# Altium project Uav.PrjPcb
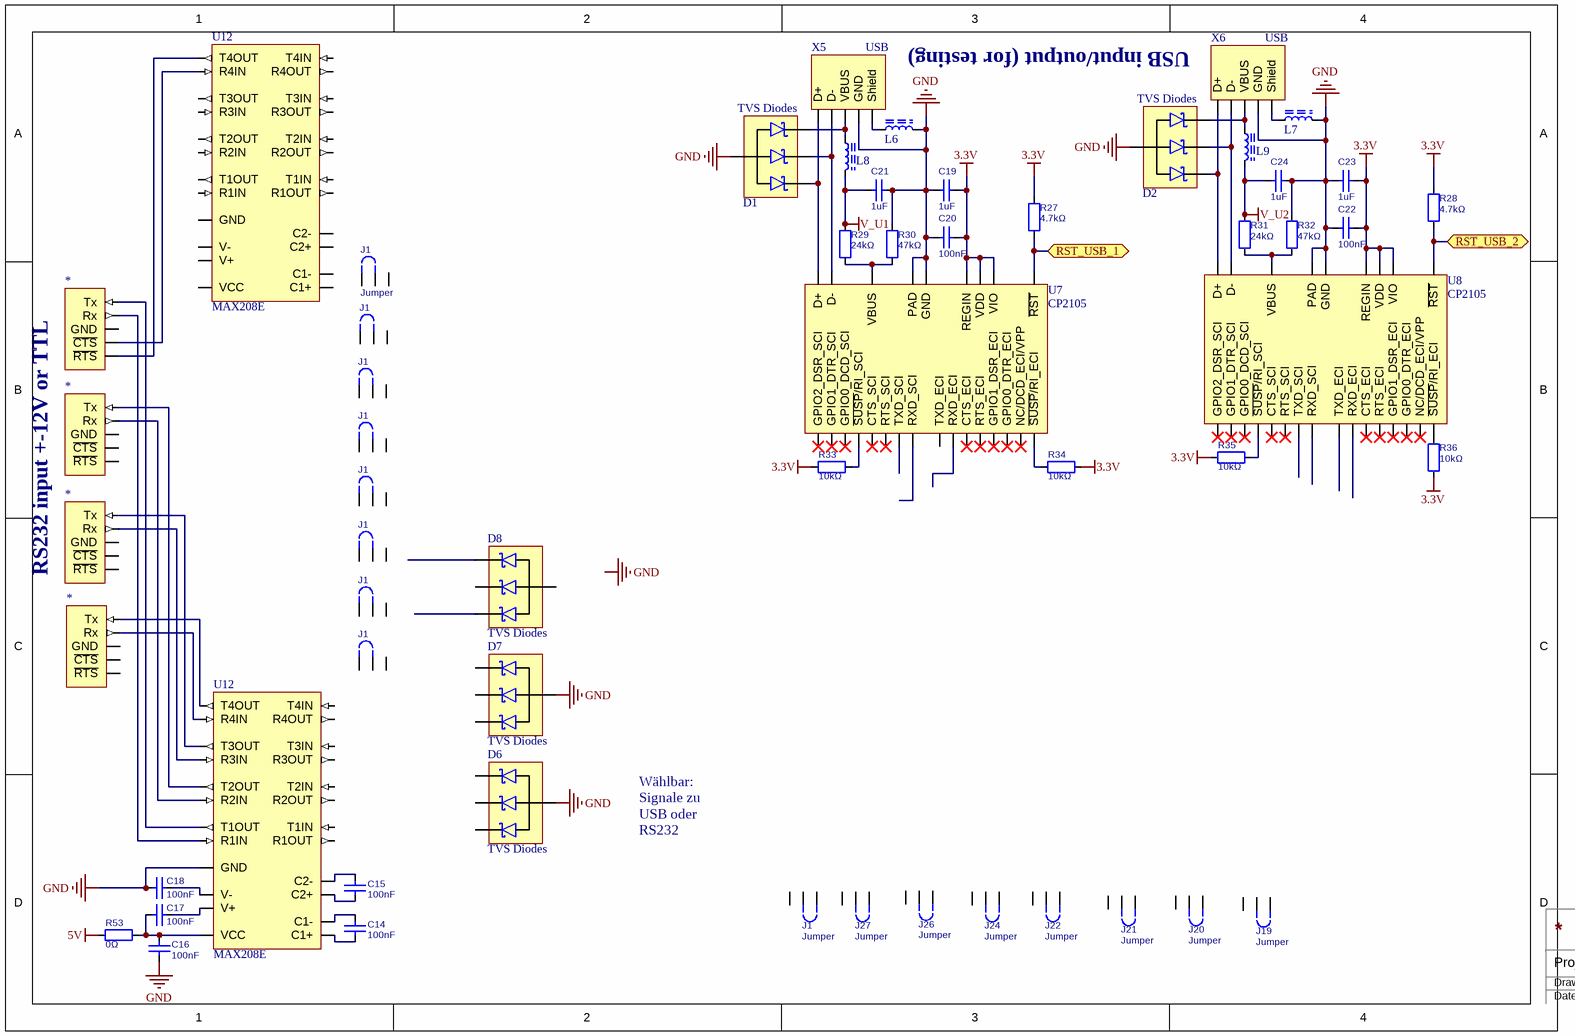
[diagram p0: DeviceDrivers.SchDoc]
2 sheets, 67 parts. Net scope: flat (ports and power ports of the same name join across sheets).
Board file: Uav_V2.PcbDoc
Sheets:
  DeviceDrivers.SchDoc
  WirelessDrivers.SchDoc

## Sheet DeviceDrivers.SchDoc
size A4; Organization: HSLU T&A; Address1: Abteilung Elektrotechnik; Address2: Technikumsstrasse 21; Address3: CH-6048 Horw

### Parts
(Parts that share a designator on the sheet are numbered #1, #2 ... from top to bottom, then left to right.)
*#1  RS232  (value not drawn)
*#2  RS232  (value not drawn)
*#3  RS232  (value not drawn)
*#4  RS232  (value not drawn)
C14  100nF  [0603]
C15  100nF  [0603]
C16  100nF  [0603]
C17  100nF  [0603]
C18  100nF  [0603]
C19  1uF  [0603]
C20  100nF  [0603]
C21  1uF  [0603]
C22  100nF  [0603]
C23  1uF  [0603]
C24  1uF  [0603]
D1  TVS Diodes  [SOT-143-4]
D2  TVS Diodes  [SOT-143-4]
D6  TVS Diodes  [SOT-143-4]
D7  TVS Diodes  [SOT-143-4]
D8  TVS Diodes  [SOT-143-4]
J1#1  Jumper  [HDR1X3]
J1#2  Jumper  [HDR1X3]  (value not drawn)
J1#3  Jumper  [HDR1X3]  (value not drawn)
J1#4  Jumper  [HDR1X3]  (value not drawn)
J1#5  Jumper  [HDR1X3]  (value not drawn)
J1#6  Jumper  [HDR1X3]  (value not drawn)
J1#7  Jumper  [HDR1X3]  (value not drawn)
J1#8  Jumper  [HDR1X3]  (value not drawn)
J1#9  Jumper  [HDR1X3]
J19  Jumper  [HDR1X3]
J20  Jumper  [HDR1X3]
J21  Jumper  [HDR1X3]
J22  Jumper  [HDR1X3]
J24  Jumper  [HDR1X3]
J26  Jumper  [HDR1X3]
J27  Jumper  [HDR1X3]
L6  MPZ1608S601A  [0603]  (value not drawn)
L7  MPZ1608S601A  [0603]  (value not drawn)
L8  MPZ1608S601A  [0603]  (value not drawn)
L9  MPZ1608S601A  [0603]  (value not drawn)
R27  4.7kΩ  [0603]
R28  4.7kΩ  [0603]
R29  24kΩ  [0603]
R30  47kΩ  [0603]
R31  24kΩ  [0603]
R32  47kΩ  [0603]
R33  10kΩ  [0603]
R34  10kΩ  [0603]
R35  10kΩ  [0603]
R36  10kΩ  [0603]
R53  0Ω  [0603]
U7  CP2105  [QFN24]
U8  CP2105  [QFN24]
U12#1  MAX208E  [SSOP24]
U12#2  MAX208E  [SSOP24]
X5  USB  [ZX63-B-5PA(30)]
X6  USB  [ZX63-B-5PA(30)]

### Ports
RST_USB_1, RST_USB_2

### Nets
3.3V: C19.1 C20.1 C22.1 C23.1 R27.2 R28.2 R33.2 R34.1 R35.2 R36.1 U7.5(VIO) U7.6(VDD) U7.7(REGIN) U8.5(VIO) U8.6(VDD) U8.7(REGIN)
5V: R53.2
GND: C16.2 C18.1 C19.2 C20.2 C21.1 C22.2 C23.2 C24.1 D1.1(CA) D2.1(CA) D6.1(CA) D7.1(CA) L6.2 L7.2 R30.1 R32.1 U7.2(GND) U7.25(PAD) U8.2(GND) U8.25(PAD) U12#2.8(GND) X5.4(GND) X6.4(GND)
V_U1: C21.2 L8.2 R29.1
V_U2: C24.2 L9.2 R31.1
Net*#1_1: *#1.1(Tx) U12#2.2(T1OUT)
Net*#1_2: *#1.2(Rx) U12#2.7(R1IN)
Net*#1_3: *#1.3(GND) U12#1.16(R4IN)
Net*#1_3: *#1.3(~{RTS}) U12#1.20(T4OUT)  [a separate net that carries the same name]
Net*#2_1: *#2.1(Tx) U12#2.1(T2OUT)
Net*#2_2: *#2.2(Rx) U12#2.3(R2IN)
Net*#3_1: *#3.1(Tx) U12#2.24(T3OUT)
Net*#3_2: *#3.2(Rx) U12#2.23(R3IN)
Net*#4_1: *#4.1(Tx) U12#2.20(T4OUT)
Net*#4_2: *#4.2(Rx) U12#2.16(R4IN)
NetC14_1: C14.1 U12#2.12(C1-)
NetC14_2: C14.2 U12#2.10(C1+)
NetC15_1: C15.1 U12#2.14(C2-)
NetC15_2: C15.2 U12#2.13(C2+)
NetC16_1: C16.1 C17.1 R53.1 U12#2.9(VCC)
NetC17_2: C17.2 U12#2.11(V+)
NetC18_2: C18.2 U12#2.15(V-)
NetD1_2: D1.2(K1) U7.3(D+) X5.3(D+)
NetD1_3: D1.3(K2) U7.4(D-) X5.2(D-)
NetD1_4: D1.4(K3) L8.1 X5.1(VBUS)
NetD2_2: D2.2(K1) U8.3(D+) X6.3(D+)
NetD2_3: D2.3(K2) U8.4(D-) X6.2(D-)
NetD2_4: D2.4(K3) L9.1 X6.1(VBUS)
NetL6_1: L6.1 X5.0(Shield)
NetL7_1: L7.1 X6.0(Shield)
NetR27_1: R27.1 U7.9(~{RST}) ; port RST_USB_1
NetR28_1: R28.1 U8.9(~{RST}) ; port RST_USB_2
NetR29_2: R29.2 R30.2 U7.8(VBUS)
NetR31_2: R31.2 R32.2 U8.8(VBUS)
NetR33_1: R33.1 U7.1(~{SUSP}/RI_SCI)
NetR34_2: R34.2 U7.17(~{SUSP}/RI_ECI)
NetR35_1: R35.1 U8.1(~{SUSP}/RI_SCI)
NetR36_2: R36.2 U8.17(~{SUSP}/RI_ECI)

Not connected (* = marked no-connect by the designer): *#2 3(GND); *#3 3(GND); *#4 3(GND); D6 2(K1) 3(K2) 4(K3); D7 2(K1) 3(K2) 4(K3); D8 1(CA) 2(K1) 3(K2) 4(K3); J1#1 1 2 3; J1#2 1 2 3; J1#3 1 2 3; J1#4 1 2 3; J1#5 1 2 3; J1#6 1 2 3; J1#7 1 2 3; J1#8 1 2 3; J1#9 1 2 3; J19 1 2 3; J20 1 2 3; J21 1 2 3; J22 1 2 3; J24 1 2 3; J26 1 2 3; J27 1 2 3; U7 10(CTS_ECI)* 11(RTS_ECI)* 12(RXD_ECI) 13(TXD_ECI) 14(GPIO1_DSR_ECI)* 15(GPIO0_DTR_ECI)* 16(NC/DCD_ECI/VPP)* 18(CTS_SCI)* 19(RTS_SCI)* 20(RXD_SCI) 21(TXD_SCI) 22(GPIO2_DSR_SCI)* 23(GPIO1_DTR_SCI)* 24(GPIO0_DCD_SCI)*; U8 10(CTS_ECI)* 11(RTS_ECI)* 12(RXD_ECI) 13(TXD_ECI) 14(GPIO1_DSR_ECI)* 15(GPIO0_DTR_ECI)* 16(NC/DCD_ECI/VPP)* 18(CTS_SCI)* 19(RTS_SCI)* 20(RXD_SCI) 21(TXD_SCI) 22(GPIO2_DSR_SCI)* 23(GPIO1_DTR_SCI)* 24(GPIO0_DCD_SCI)*; U12#1 1(T2OUT) 2(T1OUT) 3(R2IN) 4(R2OUT) 5(T1IN) 6(R1OUT) 7(R1IN) 8(GND) 9(VCC) 10(C1+) 11(V+) 12(C1-) 13(C2+) 14(C2-) 15(V-) 17(R4OUT) 18(T2IN) 19(T3IN) 21(T4IN) 22(R3OUT) 23(R3IN) 24(T3OUT); U12#2 4(R2OUT) 5(T1IN) 6(R1OUT) 17(R4OUT) 18(T2IN) 19(T3IN) 21(T4IN) 22(R3OUT)

### Notes on the sheet
- USB input/output (for testing)
- (near *#1) RS232 input +-12V or TTL
- Wählbar: Signale zu USB oder RS232
- Labels drawn without touching a wire or pin: GND
- Project:
- Drawn by:
- Size:
- Sheet
- A3
- Rev.:
- of
- Date:
- File:

### Library data of the parts
*#1-*#4 = Rs232InclHwFlowControlConnector
C14-C24 = 4: Keramikkondensator 0603; Changed by: taalbiss; Number of pads: 2; Part ID: 4; Category: Capacitors - Ceramic; Distributor: Mouser; Distributor Order Number: 0; ComponentLink1URL: http://www.mouser.ch/Passive-Components/Capacitors/Ceramic-Capacitors/MLCCs-Multilayer-Ceramic-Capacitors/Multilayer-Ceramic-Capacitors-MLCC-SMD-SMT/_/N-bkrdv?P=1yzmou6; ComponentLink1Description: Mouser 0603 Ceramic Capacitors; Price: 0; Changed at: 21.07.2015 17:44:32; SMD: True
D1 D2 D6-D8 = TVS_Diode_3fach: Distributor Order Number: 576-SP0503BAHTG; Distributor: Mouser
J1#1-J1#9 J19-J22 J24 J26 J27 = 107: Jumper THT 2.54mm 1x3; Changed by: taalbiss; Number of pads: 3; Part ID: 107; Category: Connectors; Distributor: ?; Distributor Order Number: 0; Price: 0; Changed at: 26.08.2015 10:33:14; SMD: False
L6-L9 = 45: Ferrit 0603; Changed by: taalbiss; Number of pads: 2; Part ID: 45; Category: Ferrites; Distributor: Mouser; Distributor Order Number: 810-MPZ1608S601A; ComponentLink1URL: http://www.mouser.ch/Passive-Components/EMI-RFI-Components/EMI-Filter-Beads-Chips-Arrays/_/N-bw7pa?P=1yzvlkx; ComponentLink1Description: Mouser 0603 Ferrites; Price: 0; Changed at: 03.08.2015 14:45:01; SMD: True
R27-R36 R53 = 2: Widerstand 0603; Changed by: taalbiss; Number of pads: 2; Part ID: 2; Category: Resistors; Distributor: Mouser; ComponentLink1URL: http://www.mouser.ch/Passive-Components/Resistors/SMD-Resistors-Chip-Resistors/_/N-7h7yu?P=1yzmou6; ComponentLink1Description: Mouser 0603 Resistors; Price: 0; Changed at: 21.07.2015 17:44:48; SMD: True
  R27 R28: Distributor Order Number: 660-RK73H1JTTD4701F
  R29 R31: Distributor Order Number: 71-CRCW0603-24K-E3
  R30 R32: Distributor Order Number: 755-KTR03EZPF4702
  R33-R36: Distributor Order Number: 71-CRCW0603-10K-E3
  R53: Distributor Order Number: 0
U7 U8 = CP2105: Distributor Order Number: 634-CP2105-F01-GM; Distributor: Mouser
U12#1 U12#2 = MAX208E: Distributor Order Number: 700-MAX208ECAG; Distributor: Mouser
X5 X6 = USB: Distributor Order Number: ZX62-B-5PA(30); Distributor: Mouser

## Sheet WirelessDrivers.SchDoc
size A4; Organization: HSLU T&A; Address1: Abteilung Elektrotechnik; Address2: Technikumsstrasse 21; Address3: CH-6048 Horw
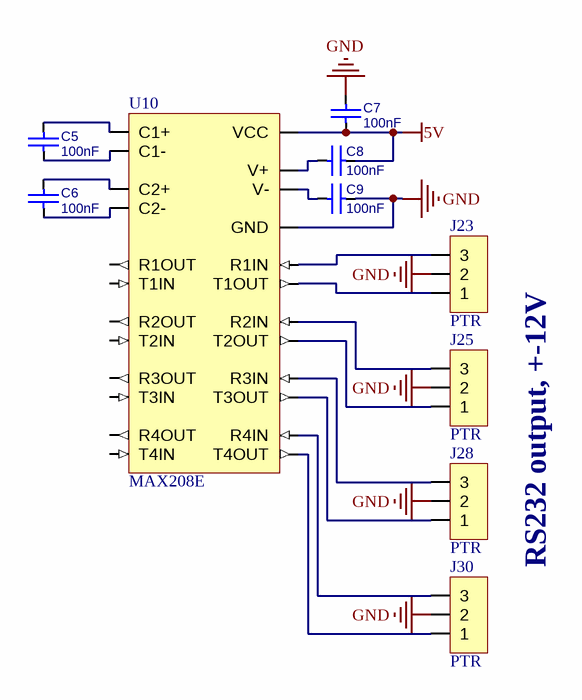
[diagram p1: WirelessDrivers.SchDoc]

### Parts
C5  100nF  [0603]
C6  100nF  [0603]
C7  100nF  [0603]
C8  100nF  [0603]
C9  100nF  [0603]
J23  PTR  [PTR_1X3]
J25  PTR  [PTR_1X3]
J28  PTR  [PTR_1X3]
J30  PTR  [PTR_1X3]
U10  MAX208E  [SSOP24]

### Nets
5V: C7.1 C8.1 U10.9(VCC)
GND: C7.2 C9.1 J23.2 J25.2 J28.2 J30.2 U10.8(GND)
NetC5_1: C5.1 U10.12(C1-)
NetC5_2: C5.2 U10.10(C1+)
NetC6_1: C6.1 U10.14(C2-)
NetC6_2: C6.2 U10.13(C2+)
NetC8_2: C8.2 U10.11(V+)
NetC9_2: C9.2 U10.15(V-)
NetJ23_1: J23.1 U10.2(T1OUT)
NetJ23_3: J23.3 U10.7(R1IN)
NetJ25_1: J25.1 U10.1(T2OUT)
NetJ25_3: J25.3 U10.3(R2IN)
NetJ28_1: J28.1 U10.24(T3OUT)
NetJ28_3: J28.3 U10.23(R3IN)
NetJ30_1: J30.1 U10.20(T4OUT)
NetJ30_3: J30.3 U10.16(R4IN)

Not connected (* = marked no-connect by the designer): U10 4(R2OUT) 5(T1IN) 6(R1OUT) 17(R4OUT) 18(T2IN) 19(T3IN) 21(T4IN) 22(R3OUT)

### Notes on the sheet
- RS232 output, +-12V
- Project:
- Drawn by:
- Size:
- Sheet
- A3
- Rev.:
- of
- Date:
- File:

### Library data of the parts
C5-C9 = 4: as C14 on sheet DeviceDrivers; Part ID: 4; Category: Capacitors - Ceramic; Distributor: Mouser; Distributor Order Number: 0; ComponentLink1URL: http://www.mouser.ch/Passive-Components/Capacitors/Ceramic-Capacitors/MLCCs-Multilayer-Ceramic-Capacitors/Multilayer-Ceramic-Capacitors-MLCC-SMD-SMT/_/N-bkrdv?P=1yzmou6; ComponentLink1Description: Mouser 0603 Ceramic Capacitors; Price: 0; Changed at: 21.07.2015 17:44:32; SMD: True
J23 J25 J28 J30 = Header_1x3: Distributor: Distrelec; Distributor Order Number: STLZ1550/03-3.81-H
U10 = MAX208E: Distributor Order Number: 700-MAX208ECAG; Distributor: Mouser

## Nets that join several sheets
5V: DeviceDrivers (R53.2), WirelessDrivers (C7.1 C8.1 U10.9)
GND: DeviceDrivers (23 pins), WirelessDrivers (7 pins)